# EAGLE schematic umni-ultra-controller (EAGLE 9.4.2)
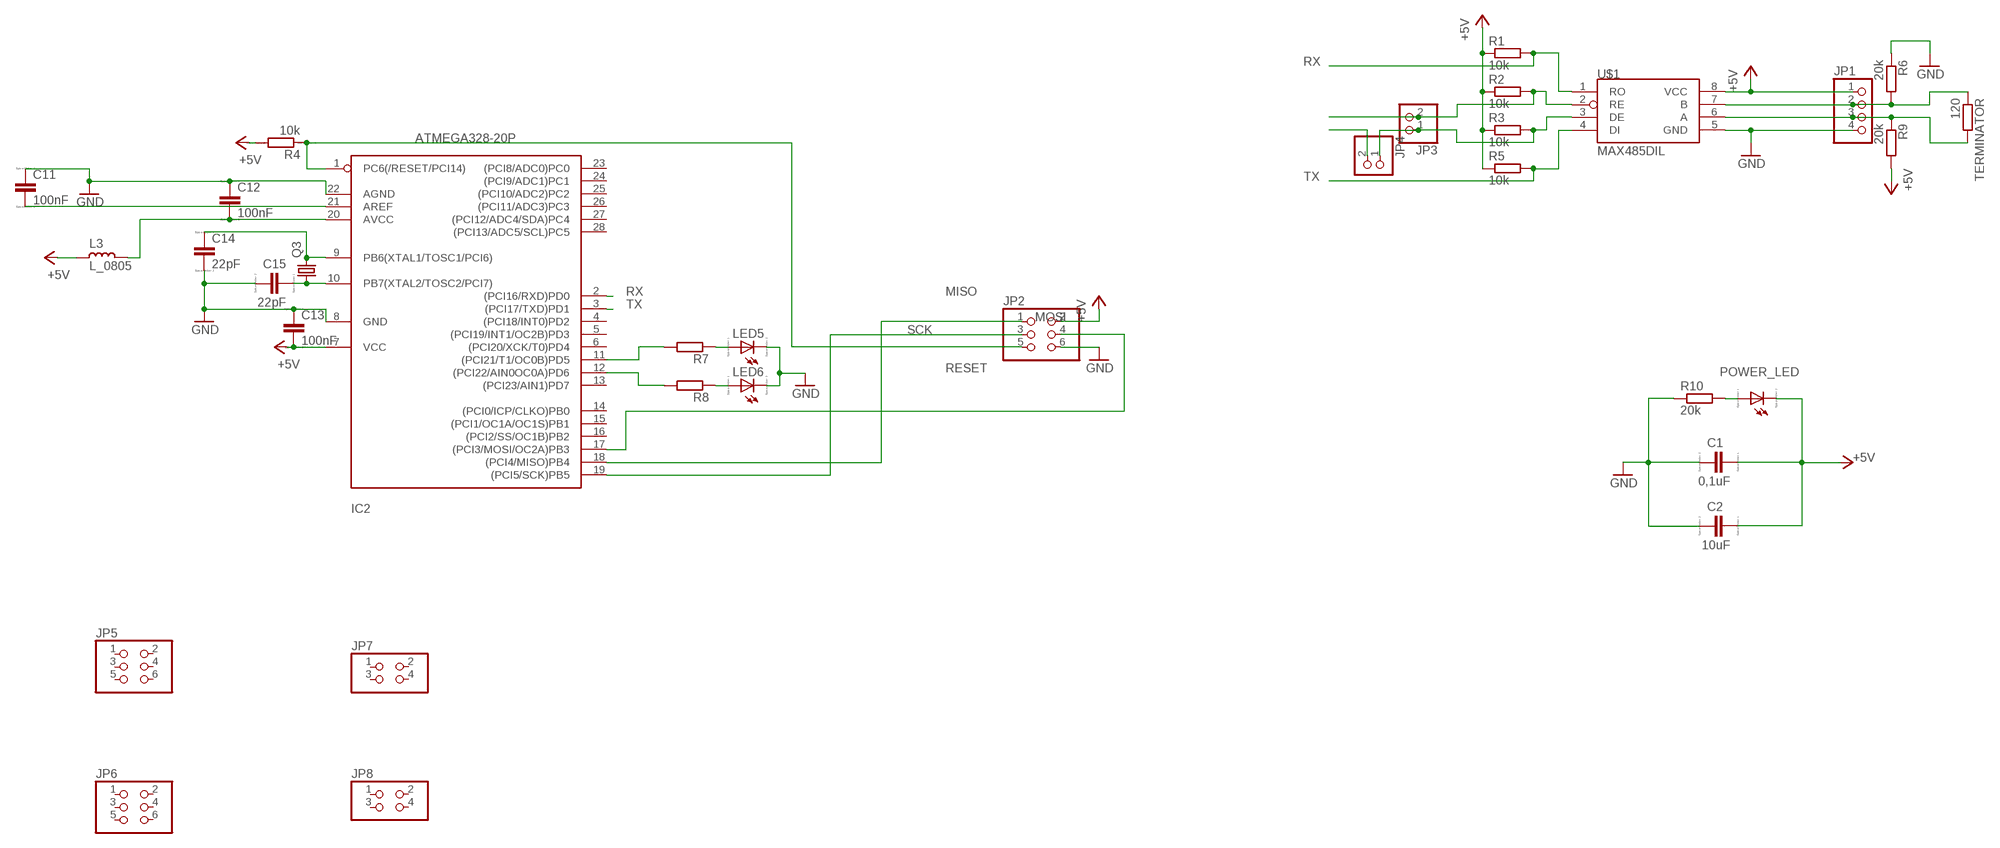
[diagram p0: schematic, sheet 1]

## Parts
C1  0,1uF  CC1206  [C1206]
C2  10uF  CC1206  [C1206]
C11  100nF  CC1206  [C1206]
C12  100nF  CC1206  [C1206]
C13  100nF  CC1206  [C1206]
C14  22pF  CC1206  [C1206]
C15  22pF  CC1206  [C1206]
IC2  ATMEGA328-20P  [DIL28-3]
JP1  PINHD-1X4  [1X04]
JP2  PINHD-2X3  [2X03]
JP3  PINHD-1X2  [1X02]
JP4  PINHD-1X2  [1X02]
JP5  PINHD-2X3  [2X03]
JP6  PINHD-2X3  [2X03]
JP7  PINHD-2X2  [2X02]
JP8  PINHD-2X2  [2X02]
L3  L_0805  [L0805]
LED5  LED_E  [LED_1206]
LED6  LED_E  [LED_1206]
POWER_LED  LED_E  [LED_1206]
Q3  CRYSTALHC49U-V  [HC49U-V]
R1  10k  R-EU_R1206  [R1206]
R2  10k  R-EU_R1206  [R1206]
R3  10k  R-EU_R1206  [R1206]
R4  10k  RR1206  [R1206]
R5  10k  R-EU_R1206  [R1206]
R6  20k  R-EU_R1206  [R1206]
R7  R-EU_R1206  [R1206]
R8  R-EU_R1206  [R1206]
R9  20k  R-EU_R1206  [R1206]
R10  20k  R-EU_R1206  [R1206]
TERMINATOR  120  R-EU_R1206  [R1206]
U$1  MAX485DIL  [DIL08]

## Nets
+5V: C1.1 C2.1 C13.2 IC2.7(VCC) JP1.1 JP2.2 L3.2 POWER_LED.C R1.1 R2.1 R3.1 R4.2 R5.1 R9.2 U$1.8(VCC)
GND: C1.2 C2.2 C11.1 C12.1 C13.1 C14.2 C15.2 IC2.8(GND) IC2.22(AGND) JP1.4 JP2.6 LED5.C LED6.C R6.1 R10.1 U$1.5(GND)
LED5: IC2.11((PCI21/T1/OC0B)PD5) R7.2
LED6: IC2.12((PCI22/AIN0OC0A)PD6) R8.2
MISO: IC2.18((PCI4/MISO)PB4) JP2.1
MOSI: IC2.17((PCI3/MOSI/OC2A)PB3) JP2.4
N$1: JP1.2 R6.2 TERMINATOR.1 U$1.7(B)
N$2: JP1.3 R9.1 TERMINATOR.2 U$1.6(A)
N$4: JP3.2 R2.2 U$1.2(RE)
N$5: JP3.1 JP4.1 R3.2 U$1.3(DE)
N$7: POWER_LED.A R10.2
N$8: JP4.2
N$9: C11.2 IC2.21(AREF)
N$10: C12.2 IC2.20(AVCC) L3.1
N$11: LED5.A R7.1
N$12: LED6.A R8.1
N$13: C14.1 IC2.9(PB6(XTAL1/TOSC1/PCI6)) Q3.2
N$14: C15.1 IC2.10(PB7(XTAL2/TOSC2/PCI7)) Q3.1
RESET: IC2.1(PC6(/RESET/PCI14)) JP2.5 R4.1
RX: IC2.2((PCI16/RXD)PD0) R1.2 U$1.1(RO)
SCK: IC2.19((PCI5/SCK)PB5) JP2.3
TX: IC2.3((PCI17/TXD)PD1) R5.2 U$1.4(DI)
Unconnected: IC2.4((PCI18/INT0)PD2) IC2.5((PCI19/INT1/OC2B)PD3) IC2.6((PCI20/XCK/T0)PD4) IC2.13((PCI23/AIN1)PD7) IC2.14((PCI0/ICP/CLKO)PB0) IC2.15((PCI1/OC1A/OC1S)PB1) IC2.16((PCI2/SS/OC1B)PB2) IC2.23((PCI8/ADC0)PC0) IC2.24((PCI9/ADC1)PC1) IC2.25((PCI10/ADC2)PC2) IC2.26((PCI11/ADC3)PC3) IC2.27((PCI12/ADC4/SDA)PC4) IC2.28((PCI13/ADC5/SCL)PC5) JP5.1 JP5.2 JP5.3 JP5.4 JP5.5 JP5.6 JP6.1 JP6.2 JP6.3 JP6.4 JP6.5 JP6.6 JP7.1 JP7.2 JP7.3 JP7.4 JP8.1 JP8.2 JP8.3 JP8.4

## Library data of the parts
C1 C2 C11-C15 = eagle-ltspice:C: CAPACITOR, European symbol; SPICEMODEL: NONE; SPICEPREFIX: C
IC2 = atmega328:ATMEGA328*P: MICROCONTROLLER 32 kBytes FLASH 2 kBytes SRAM 1 kBytes EEPROM USART 8-channel 10 bit ADC
JP1 = pinhead:PINHD-1X4: PIN HEADER
JP2 JP5 JP6 = pinhead:PINHD-2X3: PIN HEADER
JP3 JP4 = pinhead:PINHD-1X2: PIN HEADER
JP7 JP8 = pinhead:PINHD-2X2: PIN HEADER
L3 = rc-master-smd:L_: INDUCTOR
LED5 LED6 POWER_LED = eagle-ltspice:LED_E: LED Source: http://www.osram.convergy.de Source: www.luxeon.com Source: www.kingbright.com; SPICEMODEL: NONE; SPICEPREFIX: D; SPICETYPE: diode
Q3 = crystal:CRYSTAL: CRYSTAL; OC_FARNELL: 1666969; OC_NEWARK: unknown
R1-R3 R5-R10 TERMINATOR = resistor:R-EU_: RESISTOR, European symbol
R4 = eagle-ltspice:R: RESISTOR, European symbol; SPICEMODEL: NONE; SPICEPREFIX: R
U$1 = MAX485:MAX485; AVAILABILITY: Unavailable; MF: Maxim Integrated; MP: MAX485; PACKAGE: SOIC-8 Maxim Integrated; PRICE: None

## Net classes
0 default: width 0.406 mm